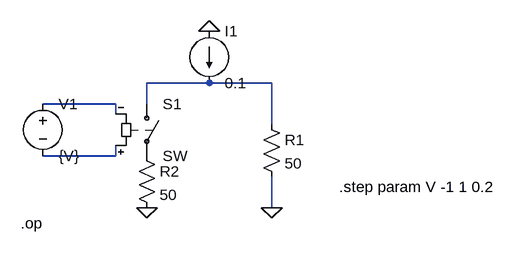
[diagram p0: schematic switch.asc]
switch.asc, the LTspice schematic file:
Version 4
SHEET 1 880 680
WIRE 112 128 16 128
WIRE 208 128 112 128
WIRE -32 160 -144 160
WIRE 16 160 16 128
WIRE -32 176 -32 160
WIRE 208 192 208 128
WIRE -32 240 -32 224
WIRE -32 240 -144 240
WIRE 208 320 208 272
FLAG 16 320 0
FLAG 208 320 0
FLAG 112 48 0
SYMBOL sw 16 144 R0
SYMATTR InstName S1
SYMBOL res 192 176 R0
SYMATTR InstName R1
SYMATTR Value 50
SYMBOL res 0 224 R0
SYMATTR InstName R2
SYMATTR Value 50
SYMBOL voltage -144 144 R0
SYMATTR InstName V1
SYMATTR Value {V}
SYMBOL current 112 48 R0
SYMATTR InstName I1
SYMATTR Value 0.1
TEXT 312 288 Left 0 !.step param V -1 1 0.2
TEXT -178 344 Left 0 !.op

The netlist it stands for:
* switch.asc
S1 N001 P001 N003 N002 SW
R1 N001 0 50
R2 P001 0 50
V1 N002 N003 {V}
I1 0 N001 0.1
.step param V -1 1 0.2
.op
.backanno
.end